# Altium schematic sheet Breakout_SOC.SchDoc
size C; DocumentNumber: 8; SheetNumber: 8; SheetTotal: 8
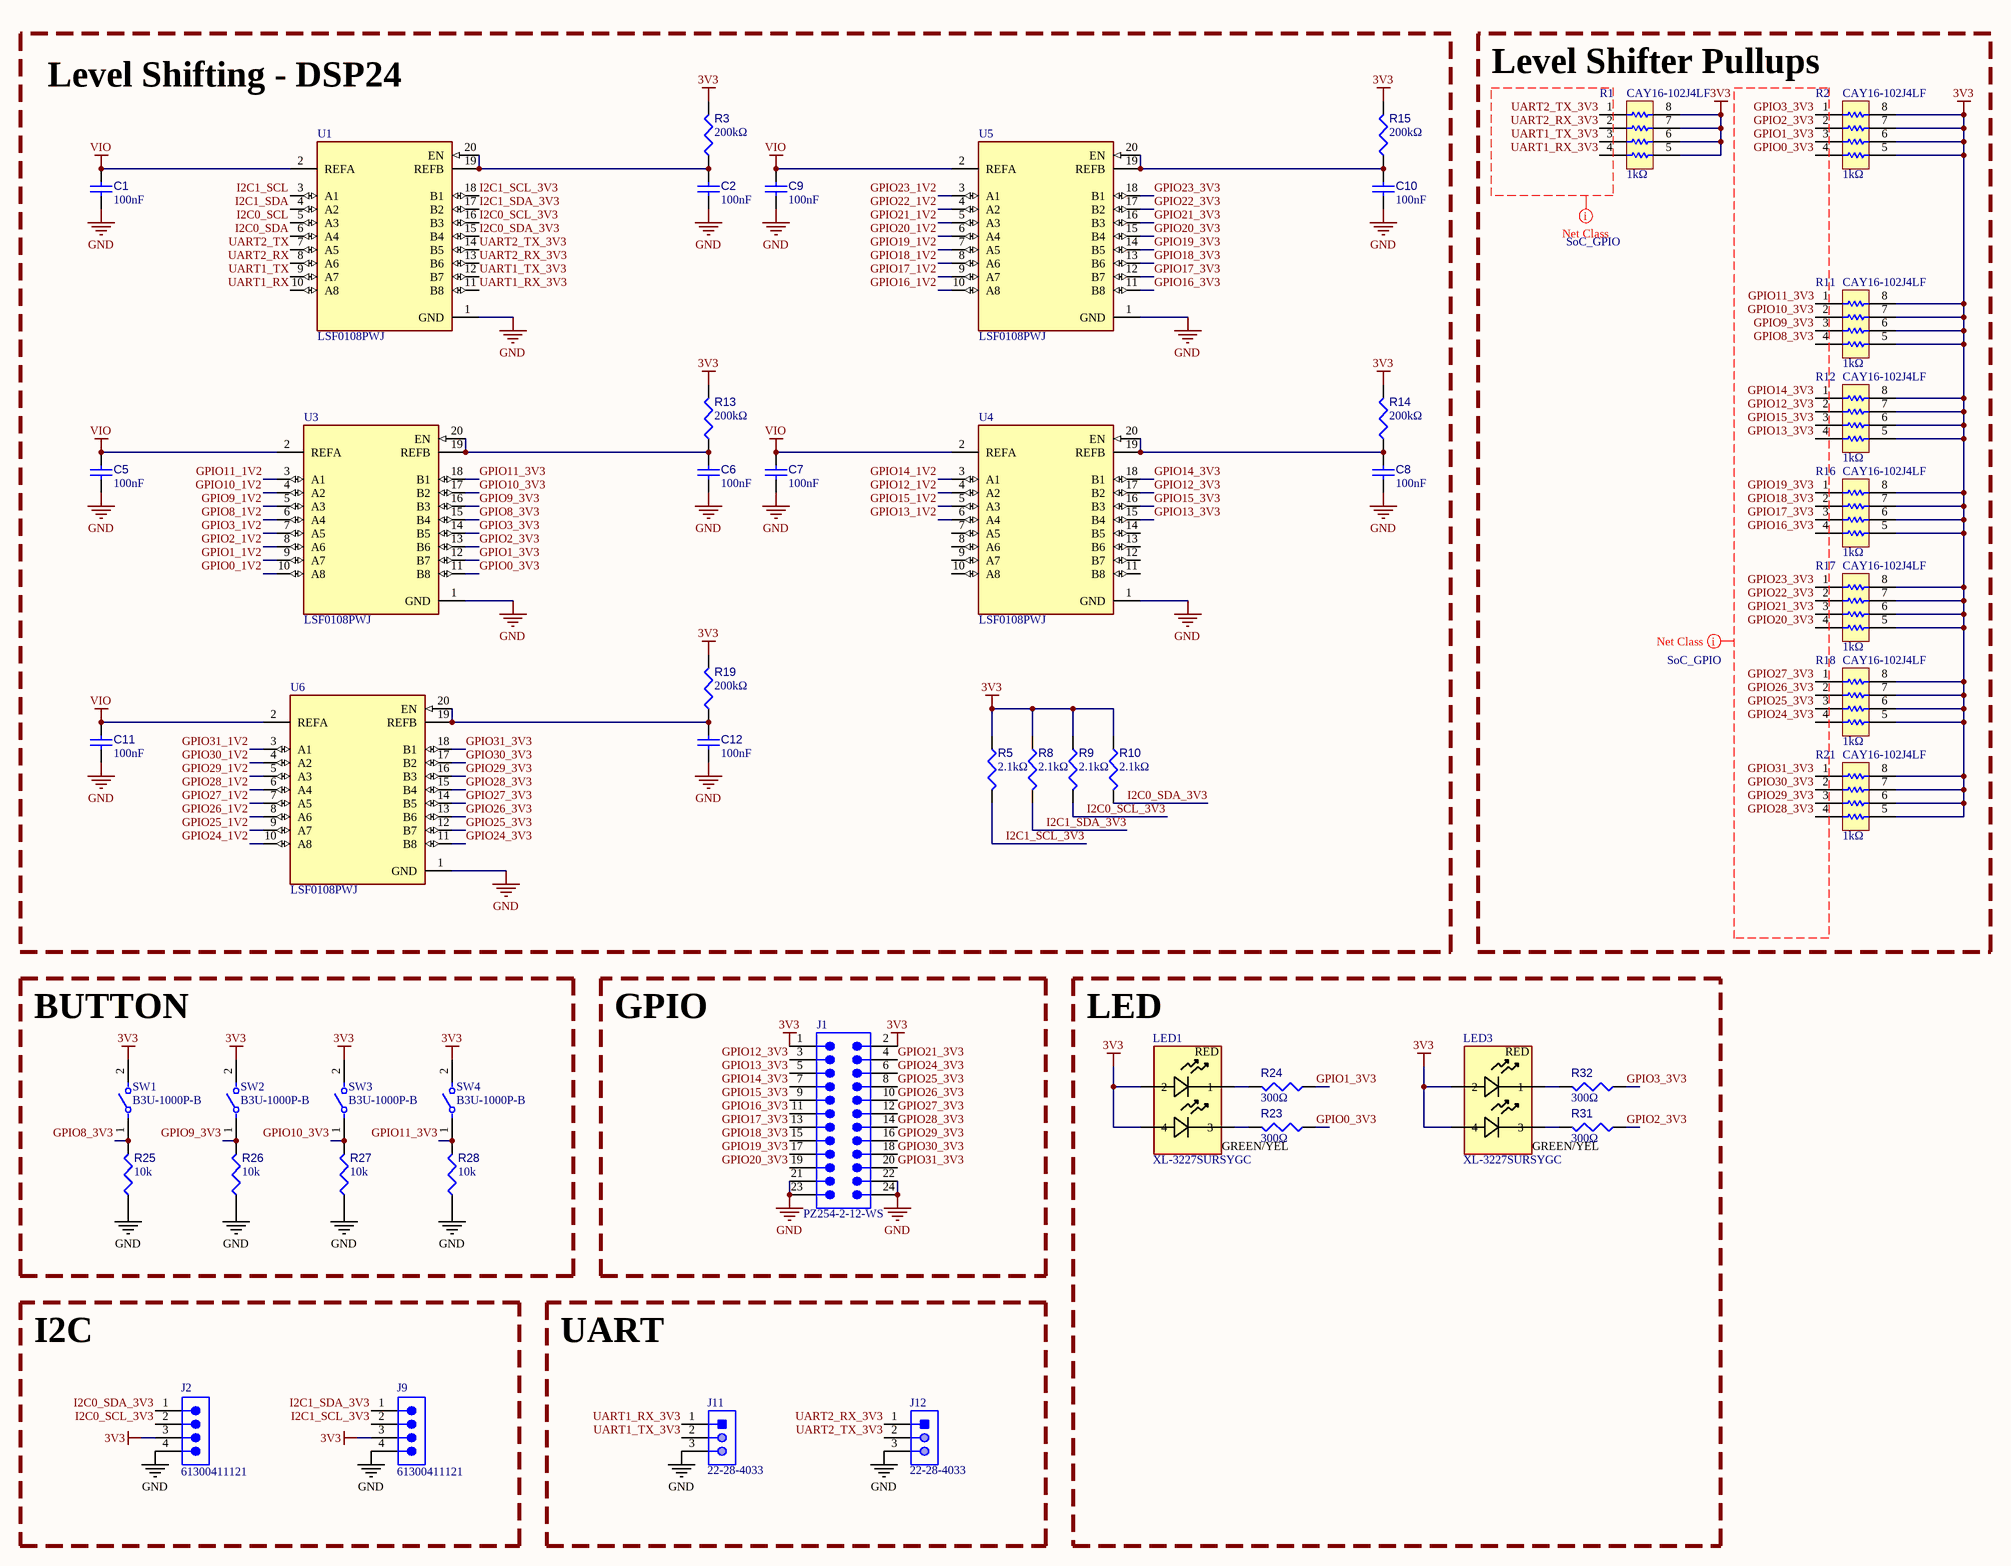
[diagram p0: Breakout_SOC.SchDoc]

## Parts
C1  value 100nF  [CAP-0402-MFG]  (hidden comment: CL05B104KO5VPNC)
C2  value 100nF  [CAP-0402-MFG]  (hidden comment: CL05B104KO5VPNC)
C5  value 100nF  [CAP-0402-MFG]  (hidden comment: CL05B104KO5VPNC)
C6  value 100nF  [CAP-0402-MFG]  (hidden comment: CL05B104KO5VPNC)
C7  value 100nF  [CAP-0402-MFG]  (hidden comment: CL05B104KO5VPNC)
C8  value 100nF  [CAP-0402-MFG]  (hidden comment: CL05B104KO5VPNC)
C9  value 100nF  [CAP-0402-MFG]  (hidden comment: CL05B104KO5VPNC)
C10  value 100nF  [CAP-0402-MFG]  (hidden comment: CL05B104KO5VPNC)
C11  value 100nF  [CAP-0402-MFG]  (hidden comment: CL05B104KO5VPNC)
C12  value 100nF  [CAP-0402-MFG]  (hidden comment: CL05B104KO5VPNC)
J1  PZ254-2-12-WS  [610124249121]
J2  61300411121  [61300411121]
J9  61300411121  [61300411121]
J11  22-28-4033  [MOLX-22-28-4033_V]
J12  22-28-4033  [MOLX-22-28-4033_V]
LED1  XL-3227SURSYGC  [LED-1210-4P-MFG]
LED3  XL-3227SURSYGC  [LED-1210-4P-MFG]
R1  CAY16-102J4LF  value 1kΩ  [RES-4x0603-MFG]
R2  CAY16-102J4LF  value 1kΩ  [RES-4x0603-MFG]
R3  value 200kΩ  [RES-0402]  (hidden comment: AC0402FR-07200KL)
R5  value 2.1kΩ  [RES-0402]  (hidden comment: CRCW04022K10FKED)
R8  value 2.1kΩ  [RES-0402]  (hidden comment: CRCW04022K10FKED)
R9  value 2.1kΩ  [RES-0402]  (hidden comment: CRCW04022K10FKED)
R10  value 2.1kΩ  [RES-0402]  (hidden comment: CRCW04022K10FKED)
R11  CAY16-102J4LF  value 1kΩ  [RES-4x0603-MFG]
R12  CAY16-102J4LF  value 1kΩ  [RES-4x0603-MFG]
R13  value 200kΩ  [RES-0402]  (hidden comment: AC0402FR-07200KL)
R14  value 200kΩ  [RES-0402]  (hidden comment: AC0402FR-07200KL)
R15  value 200kΩ  [RES-0402]  (hidden comment: AC0402FR-07200KL)
R16  CAY16-102J4LF  value 1kΩ  [RES-4x0603-MFG]
R17  CAY16-102J4LF  value 1kΩ  [RES-4x0603-MFG]
R18  CAY16-102J4LF  value 1kΩ  [RES-4x0603-MFG]
R19  value 200kΩ  [RES-0402]  (hidden comment: AC0402FR-07200KL)
R21  CAY16-102J4LF  value 1kΩ  [RES-4x0603-MFG]
R23  value 300Ω  [RES-0402]  (hidden comment: AC0402FR-07300RL)
R24  value 300Ω  [RES-0402]  (hidden comment: AC0402FR-07300RL)
R25  value 10k  [RES-0402]  (hidden comment: AC0402FR-0710KL)
R26  value 10k  [RES-0402]  (hidden comment: AC0402FR-0710KL)
R27  value 10k  [RES-0402]  (hidden comment: AC0402FR-0710KL)
R28  value 10k  [RES-0402]  (hidden comment: AC0402FR-0710KL)
R31  value 300Ω  [RES-0402]  (hidden comment: AC0402FR-07300RL)
R32  value 300Ω  [RES-0402]  (hidden comment: AC0402FR-07300RL)
SW1  B3U-1000P-B  [FP-B3U-1000P-B-MFG]
SW2  B3U-1000P-B  [FP-B3U-1000P-B-MFG]
SW3  B3U-1000P-B  [FP-B3U-1000P-B-MFG]
SW4  B3U-1000P-B  [FP-B3U-1000P-B-MFG]
U1  LSF0108PWJ  [FP-TSSOP20-MFG]
U3  LSF0108PWJ  [FP-TSSOP20-MFG]
U4  LSF0108PWJ  [FP-TSSOP20-MFG]
U5  LSF0108PWJ  [FP-TSSOP20-MFG]
U6  LSF0108PWJ  [FP-TSSOP20-MFG]

## Blocks framed on the sheet
Level Shifting - DSP24: C1 C2 C5-C12 R3 R5 R8-R10 R13-R15 R19 U1 U3-U6
Level Shifter Pullups: R1 R2 R11 R12 R16-R18 R21
BUTTON: R25-R28 SW1-SW4
GPIO: J1
LED: LED1 LED3 R23 R24 R31 R32
I2C: J2 J9
UART: J11 J12

## Nets
3V3: J1.1 J1.2 J2.3 J9.3 LED1.2 LED1.4 LED3.2 LED3.4 R1.5 R1.6 R1.7 R1.8 R2.5 R2.6 R2.7 R2.8 R3.2 R5.1 R8.1 R9.1 R10.1 R11.5 R11.6 R11.7 R11.8 R12.5 R12.6 R12.7 R12.8 R13.2 R14.2 R15.2 R16.5 R16.6 R16.7 R16.8 R17.5 R17.6 R17.7 R17.8 R18.5 R18.6 R18.7 R18.8 R19.2 R21.5 R21.6 R21.7 R21.8 SW1.2 SW2.2 SW3.2 SW4.2
GND: C1.1 C2.2 C5.1 C6.2 C7.1 C8.2 C9.1 C10.2 C11.2 C12.2 J1.21 J1.22 J1.23 J1.24 J2.4 J9.4 J11.3 J12.3 R25.1 R26.1 R27.1 R28.1 U1.1(GND) U3.1(GND) U4.1(GND) U5.1(GND) U6.1(GND)
VIO: C1.2 C5.2 C7.2 C9.2 C11.1 U1.2(REFA) U3.2(REFA) U4.2(REFA) U5.2(REFA) U6.2(REFA)
GPIO0_1V2: U3.10(A8)
GPIO0_3V3: R2.4 R23.2 U3.11(B8)
GPIO1_1V2: U3.9(A7)
GPIO1_3V3: R2.3 R24.2 U3.12(B7)
GPIO2_1V2: U3.8(A6)
GPIO2_3V3: R2.2 R31.2 U3.13(B6)
GPIO3_1V2: U3.7(A5)
GPIO3_3V3: R2.1 R32.2 U3.14(B5)
GPIO8_1V2: U3.6(A4)
GPIO8_3V3: R11.4 R25.2 SW1.1 U3.15(B4)
GPIO9_1V2: U3.5(A3)
GPIO9_3V3: R11.3 R26.2 SW2.1 U3.16(B3)
GPIO10_1V2: U3.4(A2)
GPIO10_3V3: R11.2 R27.2 SW3.1 U3.17(B2)
GPIO11_1V2: U3.3(A1)
GPIO11_3V3: R11.1 R28.2 SW4.1 U3.18(B1)
GPIO12_1V2: U4.4(A2)
GPIO12_3V3: J1.3 R12.2 U4.17(B2)
GPIO13_1V2: U4.6(A4)
GPIO13_3V3: J1.5 R12.4 U4.15(B4)
GPIO14_1V2: U4.3(A1)
GPIO14_3V3: J1.7 R12.1 U4.18(B1)
GPIO15_1V2: U4.5(A3)
GPIO15_3V3: J1.9 R12.3 U4.16(B3)
GPIO16_1V2: U5.10(A8)
GPIO16_3V3: J1.11 R16.4 U5.11(B8)
GPIO17_1V2: U5.9(A7)
GPIO17_3V3: J1.13 R16.3 U5.12(B7)
GPIO18_1V2: U5.8(A6)
GPIO18_3V3: J1.15 R16.2 U5.13(B6)
GPIO19_1V2: U5.7(A5)
GPIO19_3V3: J1.17 R16.1 U5.14(B5)
GPIO20_1V2: U5.6(A4)
GPIO20_3V3: J1.19 R17.4 U5.15(B4)
GPIO21_1V2: U5.5(A3)
GPIO21_3V3: J1.4 R17.3 U5.16(B3)
GPIO22_1V2: U5.4(A2)
GPIO22_3V3: R17.2 U5.17(B2)
GPIO23_1V2: U5.3(A1)
GPIO23_3V3: R17.1 U5.18(B1)
GPIO24_1V2: U6.10(A8)
GPIO24_3V3: J1.6 R18.4 U6.11(B8)
GPIO25_1V2: U6.9(A7)
GPIO25_3V3: J1.8 R18.3 U6.12(B7)
GPIO26_1V2: U6.8(A6)
GPIO26_3V3: J1.10 R18.2 U6.13(B6)
GPIO27_1V2: U6.7(A5)
GPIO27_3V3: J1.12 R18.1 U6.14(B5)
GPIO28_1V2: U6.6(A4)
GPIO28_3V3: J1.14 R21.4 U6.15(B4)
GPIO29_1V2: U6.5(A3)
GPIO29_3V3: J1.16 R21.3 U6.16(B3)
GPIO30_1V2: U6.4(A2)
GPIO30_3V3: J1.18 R21.2 U6.17(B2)
GPIO31_1V2: U6.3(A1)
GPIO31_3V3: J1.20 R21.1 U6.18(B1)
I2C0_SCL: U1.5(A3)
I2C0_SCL_3V3: J2.2 R9.2 U1.16(B3)
I2C0_SDA: U1.6(A4)
I2C0_SDA_3V3: J2.1 R10.2 U1.15(B4)
I2C1_SCL: U1.3(A1)
I2C1_SCL_3V3: J9.2 R5.2 U1.18(B1)
I2C1_SDA: U1.4(A2)
I2C1_SDA_3V3: J9.1 R8.2 U1.17(B2)
UART1_RX: U1.10(A8)
UART1_RX_3V3: J11.1 R1.4 U1.11(B8)
UART1_TX: U1.9(A7)
UART1_TX_3V3: J11.2 R1.3 U1.12(B7)
UART2_RX: U1.8(A6)
UART2_RX_3V3: J12.1 R1.2 U1.13(B6)
UART2_TX: U1.7(A5)
UART2_TX_3V3: J12.2 R1.1 U1.14(B5)
NetC2_1: C2.1 R3.1 U1.19(REFB) U1.20(EN)
NetC6_1: C6.1 R13.1 U3.19(REFB) U3.20(EN)
NetC8_1: C8.1 R14.1 U4.19(REFB) U4.20(EN)
NetC10_1: C10.1 R15.1 U5.19(REFB) U5.20(EN)
NetC12_1: C12.1 R19.1 U6.19(REFB) U6.20(EN)
NetLED1_1: LED1.1 R24.1
NetLED1_3: LED1.3 R23.1
NetLED3_1: LED3.1 R32.1
NetLED3_3: LED3.3 R31.1

Not connected (* = marked no-connect by the designer): U4 7(A5) 8(A6) 9(A7) 10(A8) 11(B8) 12(B7) 13(B6) 14(B5)

## Layout directives
net class SoC_GPIO: GPIO0_3V3, GPIO1_3V3, GPIO2_3V3, GPIO3_3V3, GPIO8_3V3, GPIO9_3V3, GPIO10_3V3, GPIO11_3V3, GPIO12_3V3, GPIO13_3V3, GPIO14_3V3, GPIO15_3V3, GPIO16_3V3, GPIO17_3V3, GPIO18_3V3, GPIO19_3V3, GPIO20_3V3, GPIO21_3V3, GPIO22_3V3, GPIO23_3V3, GPIO24_3V3, GPIO25_3V3, GPIO26_3V3, GPIO27_3V3, GPIO28_3V3, GPIO29_3V3, GPIO30_3V3, GPIO31_3V3, UART1_RX_3V3, UART1_TX_3V3, UART2_RX_3V3, UART2_TX_3V3

## Notes on the sheet
- (in symbol CMP-132-000003-3) RED; GREEN/YEL

## Library data of the parts
C1 C2 C5-C12 = CMP-104-000086-6: 0402-100n-10%-16V-X7R-AECQ200; Manufacturer Name: Murata; Capacitor Type: Ceramic; Voltage Rating: 16V; Tolerance: 10%; Temp Code: X7R; Component Type: Standard; Min Operating Temperature: -55°C; Source: Components - 11.02.26 - 17.26.SchLib; Design Item ID: CMP-001-00111-7; Pin Count: 2; Max Operating Temperature: 125°C; Case/Package: 0402; Pins: 2; Info: 0402-100n-10%-16V-X7R-AECQ200; Manufacturer Part Number: CL05B104KO5VPNC; Mounting Technology: Surface Mount; JLC PN: C307332
J1 = CMP-055-000215-1: Pin Header, 2.54MM Pitch, SMT Double Row Right Angled, 24 Pins; Manufacturer Name: HCTL; Current Rating: 3A; Connector Type: Male Pin; Gender: Male; Operating Supply Voltage: 250V; Pitch: 2.54mm; Termination: Solder; Number of Rows: 2; Pins: 24; Mounting Technology: Surface Mount; JLC PN: C5149362; Max Operating Temperature: 105°C; Manufacturer Part Number: PZ254-2-12-WS; Min Operating Temperature: -40°C
J2 J9 = CMP-00022-2: Conn Unshrouded Header HDR 4 POS 2.54mm Solder ST Thru-Hole Bag; Manufacturer Name: Wurth Electronik; Contact Resistance: 20mΩ; Current Rating: 3A; Voltage Rating: 250V; Connector Type: Male Pin; Gender: Male; Number of Rows: 1; Pitch: 2.54mm; Termination: Solder; Min Operating Temperature: -40°C; Max Operating Temperature: 105°C; JLC PN: C5184785; Manufacturer Part Number: 61300411121; Mounting Technology: Through Hole; Pins: 4
J11 J12 = CMP-055-000016-2: Board Connector, 3 Contact(s), 1 Row(s), Male, Straight, 0.1 inch Pitch, Solder Terminal, Receptacle; Manufacturer Name: Molex; JLC PN: 587037; Manufacturer Part Number: 22-28-4033
LED1 LED3 = CMP-132-000003-3: LED indicator light dual color red yellow green 1210 front facing; Manufacturer Name: XINLIGHT; Manufacturer Part Number: XL-3227SURSYGC; JLC PN: C965843
R1 R2 R11 R12 R16-R18 R21 = CMP-014-000102-1: Res Thick Film Array 1K Ohm 5% 0.25W(1/4W) ±200ppm/C ISOL 8-Pin 1206(4 X 0603) Convex SMD T/R; Manufacturer Name: Bourns; Number of Resistors: 4; Voltage Rating (DC): 50V; Power Dissipation: 250mW; Mounting Technology: Surface Mount; Tolerance: 5%; Manufacturer Part Number: CAY16-102J4LF; Min Operating Temperature: -55°C; JLC PN: C784824; Case/Package: 0603; Max Operating Temperature: 125°C; Pins: 8
R3 R13-R15 R19 = CMP-014-000126-4: 0402-200k-1%-1/16W-AEC-Q200; Manufacturer Name: YAGEO; Tolerance: 1%; Power: 63mW; Voltage Rating: 50V; Design Item ID: CMP-009-00210-1; Case/Package: 0402; Source: Components - 11.02.26 - 17.27.SchLib; Mounting Technology: Surface Mount; Min Operating Temperature: -55°C; Info: 0402-200k-1%-1/16W-AEC-Q200; Max Operating Temperature: 155°C; Pins: 2; Manufacturer Part Number: AC0402FR-07200KL; JLC PN: C144785
R5 R8-R10 = CMP-014-000127-3: 0402-2.1k-1%-1/16W-AEC-Q200; Manufacturer Name: Vishay; Power: 63mW; Tolerance: 1%; Voltage Rating: 50V; Max Operating Temperature: 155°C; Pins: 2; Design Item ID: CMP-009-00190-1; Info: 0402-2.1k-1%-1/16W-AEC-Q200; Manufacturer Part Number: CRCW04022K10FKED; Mounting Technology: Surface Mount; Component Type: Standard; Case/Package: 0402; Source: Components - 11.02.26 - 17.27.SchLib; Min Operating Temperature: -55°C; Pin Count: 2; JLC PN: C2091566
R23 R24 R31 R32 = CMP-014-000122-4: 0402-300-1%-1/16W-AEC-Q200; Manufacturer Name: YAGEO; Voltage Rating: 50V; Power: 63mW; Tolerance: 1%; Case/Package: 0402; Info: 0402-300-1%-1/16W-AEC-Q200; Pins: 2; Source: Components - 11.02.26 - 17.27.SchLib; Manufacturer Part Number: AC0402FR-07300RL; Max Operating Temperature: 155°C; Mounting Technology: Surface Mount; Design Item ID: CMP-009-00210-1; Min Operating Temperature: -55°C; JLC PN: C144768
R25-R28 = CMP-014-000077-5: 0402-10k-1%-1/16W-AEC-Q200; Manufacturer Name: YAGEO; Tolerance: 1%; Voltage Rating: 50V; Power: 63mW; Pins: 2; Source: Components - 11.02.26 - 17.27.SchLib; Manufacturer Part Number: AC0402FR-0710KL; Info: 0402-10k-1%-1/16W-AEC-Q200; Min Operating Temperature: -55°C; Pin Count: 2; Case/Package: 0402; Design Item ID: CMP-009-00191-3; Max Operating Temperature: 155°C; Component Type: Standard; Mounting Technology: Surface Mount; JLC PN: C144807
SW1-SW4 = CMP-015-000062-1: Switch Tactile N.O. SPST Round Button Gull Wing 0.05A 12VDC 1.5N SMD Embossed T/R; Manufacturer Name: Omron; Contact Resistance: 100mΩ; Switch Function: Off-Mom; Max Current Rating: 50mA; Voltage Rating (DC): 12V; Manufacturer Part Number: B3U-1000P-B; Switch Type: SPST; Max Operating Temperature: 70°C; Mounting Technology: Surface Mount; JLC PN: C231329; Min Operating Temperature: -25°C
U1 U3-U6 = CMP-051-000053-3: LSF0108 - 8-bit bidirectional multi-voltage level translator; open-drain; push-pull; Manufacturer Name: Nexperia; Operating Supply Current: 128mA; Number of Channels: 8; Min Supply Voltage: 950mV; Data Rate: 200Mbps; Max Supply Voltage: 5V; Topology: Open-Drain, Push-Pull; Pins: 20; Logic Function: Translator; Max Operating Temperature: 125°C; Min Operating Temperature: -40°C; Mounting Technology: Surface Mount; Channel Type: Bidirectional; JLC PN: C551522; Case/Package: TSSOP; Height: 1.1mm; Manufacturer Part Number: LSF0108PWJ